# Altium project BSU.PrjPcb (part 2 of 2)
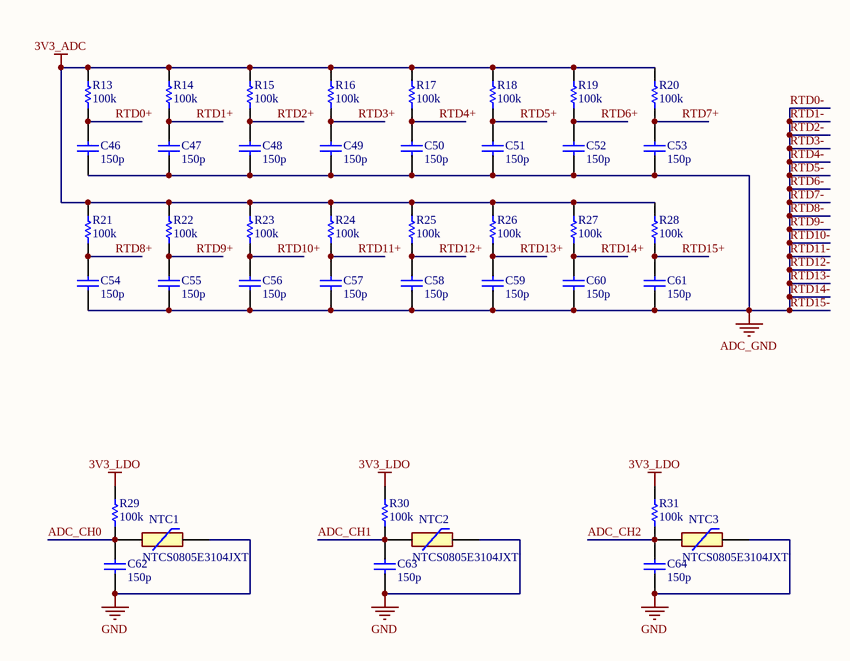
[diagram p8: BSU_RTD.SchDoc]

## Nets that join several sheets
3V3_ADC: BSU_Power (C24.2 LDO2.5), BSU_EADC (ADC1.28 ADC2.28 C33.1 C34.1), BSU_RTD (16 pins)
3V3_LDO: BSU_Connector (SB4.2), BSU_Power (C20.2 LDO1.5), BSU_RTD (R29.2 R30.2 R31.2)
+5V: BSU_Connector (J18.4 SB1.2 SB2.1 SB3.1), BSU_Power (6 pins), BSU_Comm (13 pins)
+5V_ADC: BSU_Power (6 pins), BSU_Comm (6 pins), BSU_EADC (12 pins)
+5V_STM: BSU_Connector (J5.1 STM32.28), BSU_Power (R10.2)
BAT_GND: BSU_BQ796XX (C1.2), BSU_Sensing (C81.2 C114.1 R48.1)
BQ1_GND: BSU_BQ796XX (12 pins), BSU_Comm (5 pins), BSU_Sensing (C134.1)
BQ2_GND: BSU_BQ796XX (12 pins), BSU_Comm (C141.1 C142.1), BSU_Sensing (C133.1)
CVDD1: BSU_BQ796XX (BQ1.45 C9.1), BSU_Comm (C26.2 U3.1 U3.7)
GND: BSU_Connector (23 pins), BSU_Power (14 pins), BSU_Comm (15 pins), BSU_RTD (6 pins)
RTD0-: BSU_Connector (18 pins), BSU_Power (6 pins), BSU_Comm (6 pins), BSU_ESD (8 pins), BSU_EADC (27 pins), BSU_RTD (16 pins)
VIN: BSU_Connector (J1.1), BSU_Power (X1.1)
ADC1_CS: BSU_Comm (U4.14), BSU_EADC (ADC1.23)
ADC1_MISO: BSU_Comm (U4.11), BSU_EADC (ADC1.26)
ADC1_MOSI: BSU_Comm (U4.12), BSU_EADC (ADC1.25)
ADC1_SCK: BSU_Comm (U4.13), BSU_EADC (ADC1.24)
ADC2_CS: BSU_Comm (U5.14), BSU_EADC (ADC2.23)
ADC2_MISO: BSU_Comm (U5.11), BSU_EADC (ADC2.26)
ADC2_MOSI: BSU_Comm (U5.12), BSU_EADC (ADC2.25)
ADC2_SCK: BSU_Comm (U5.13), BSU_EADC (ADC2.24)
ADC_CH0: BSU_Connector (STM32.33), BSU_RTD (C62.2 NTC1.2 R29.1)
ADC_CH1: BSU_Connector (STM32.34), BSU_RTD (C63.2 NTC2.2 R30.1)
ADC_CH2: BSU_Connector (STM32.56), BSU_RTD (C64.2 NTC3.2 R31.1)
BAT16: BSU_BQ796XX (BQ1.1), BSU_Sensing (C132.2 C134.2 R100.2)
BAT32: BSU_BQ796XX (BQ2.1), BSU_Sensing (C131.2 C133.2 R99.2)
BQ1_DAISY_N: BSU_BQ796XX (BQ1.42), BSU_Comm (C136.2 R101.2 R102.2)
BQ1_DAISY_P: BSU_BQ796XX (BQ1.43), BSU_Comm (C135.2 R101.1 R103.2)
BQ2_DAISY_N: BSU_BQ796XX (BQ2.41), BSU_Comm (C141.2 R104.2 R106.1)
BQ2_DAISY_P: BSU_BQ796XX (BQ2.40), BSU_Comm (C142.2 R105.2 R106.2)
BQ796XX_RX: BSU_Connector (STM32.20), BSU_Comm (U3.12)
BQ796XX_RX_HV: BSU_BQ796XX (BQ1.53), BSU_Comm (U3.5)
BQ796XX_TX: BSU_Connector (STM32.1), BSU_Comm (U3.11)
BQ796XX_TX_HV: BSU_BQ796XX (BQ1.52), BSU_Comm (U3.6)
BT0: BSU_Connector (J3.21), BSU_Sensing (F1.1)
BT0_F: BSU_Sensing (F1.2 R48.2 R49.1 R82.1), BSU_ESD (TVS1.2 TVS17.2)
BT1: BSU_Connector (J3.1), BSU_Sensing (F2.1)
BT1_F: BSU_Sensing (F2.2 R50.1 R83.1), BSU_ESD (TVS1.3)
BT2: BSU_Connector (J3.22), BSU_Sensing (F3.1)
BT2_F: BSU_Sensing (F3.2 R51.1 R84.1), BSU_ESD (TVS1.1 TVS2.2)
BT3: BSU_Connector (J3.2), BSU_Sensing (F4.1)
BT3_F: BSU_Sensing (F4.2 R52.1 R85.1), BSU_ESD (TVS2.3)
BT4: BSU_Connector (J3.23), BSU_Sensing (F5.1)
BT4_F: BSU_Sensing (F5.2 R53.1 R86.1), BSU_ESD (TVS2.1 TVS3.2)
BT5: BSU_Connector (J3.3), BSU_Sensing (F6.1)
BT5_F: BSU_Sensing (F6.2 R54.1 R87.1), BSU_ESD (TVS3.3)
BT6: BSU_Connector (J3.24), BSU_Sensing (F7.1)
BT6_F: BSU_Sensing (F7.2 R55.1 R88.1), BSU_ESD (TVS3.1 TVS4.2)
BT7: BSU_Connector (J3.4), BSU_Sensing (F8.1)
BT7_F: BSU_Sensing (F8.2 R56.1 R89.1), BSU_ESD (TVS4.3)
BT8: BSU_Connector (J3.25), BSU_Sensing (F9.1)
BT8_F: BSU_Sensing (F9.2 R57.1 R90.1), BSU_ESD (TVS4.1 TVS5.2)
BT9: BSU_Connector (J3.5), BSU_Sensing (F10.1)
BT9_F: BSU_Sensing (F10.2 R58.1 R91.1), BSU_ESD (TVS5.3)
BT10: BSU_Connector (J3.26), BSU_Sensing (F11.1)
BT10_F: BSU_Sensing (F11.2 R59.1 R92.1), BSU_ESD (TVS5.1 TVS6.2)
BT11: BSU_Connector (J3.6), BSU_Sensing (F12.1)
BT11_F: BSU_Sensing (F12.2 R60.1 R93.1), BSU_ESD (TVS6.3)
BT12: BSU_Connector (J3.27), BSU_Sensing (F13.1)
BT12_F: BSU_Sensing (F13.2 R61.1 R94.1), BSU_ESD (TVS6.1 TVS7.2)
BT13: BSU_Connector (J3.7), BSU_Sensing (F14.1)
BT13_F: BSU_Sensing (F14.2 R62.1 R95.1), BSU_ESD (TVS7.3)
BT14: BSU_Connector (J3.28), BSU_Sensing (F15.1)
BT14_F: BSU_Sensing (F15.2 R63.1 R96.1), BSU_ESD (TVS7.1 TVS8.2)
BT15: BSU_Connector (J3.8), BSU_Sensing (F16.1)
BT15_F: BSU_Sensing (F16.2 R64.1 R97.1), BSU_ESD (TVS8.3)
BT16: BSU_Connector (J3.29), BSU_Sensing (F17.1)
BT16_F: BSU_BQ796XX (C2.2 R2.2), BSU_Sensing (F17.2 R65.1 R98.1 R100.1), BSU_ESD (TVS8.1 TVS9.2 TVS17.1 TVS18.2)
BT17: BSU_Connector (J3.9), BSU_Sensing (F18.1)
BT17_F: BSU_Sensing (F18.2 R32.1 R66.1), BSU_ESD (TVS9.3)
BT18: BSU_Connector (J3.30), BSU_Sensing (F19.1)
BT18_F: BSU_Sensing (F19.2 R33.1 R67.1), BSU_ESD (TVS9.1 TVS10.2)
BT19: BSU_Connector (J3.10), BSU_Sensing (F20.1)
BT19_F: BSU_Sensing (F20.2 R34.1 R68.1), BSU_ESD (TVS10.3)
BT20: BSU_Connector (J3.31), BSU_Sensing (F21.1)
BT20_F: BSU_Sensing (F21.2 R35.1 R69.1), BSU_ESD (TVS10.1 TVS11.2)
BT21: BSU_Connector (J3.11), BSU_Sensing (F22.1)
BT21_F: BSU_Sensing (F22.2 R36.1 R70.1), BSU_ESD (TVS11.3)
BT22: BSU_Connector (J3.32), BSU_Sensing (F23.1)
BT22_F: BSU_Sensing (F23.2 R37.1 R71.1), BSU_ESD (TVS11.1 TVS12.2)
BT23: BSU_Connector (J3.12), BSU_Sensing (F24.1)
BT23_F: BSU_Sensing (F24.2 R38.1 R72.1), BSU_ESD (TVS12.3)
BT24: BSU_Connector (J3.33), BSU_Sensing (F25.1)
BT24_F: BSU_Sensing (F25.2 R39.1 R73.1), BSU_ESD (TVS12.1 TVS13.2)
BT25: BSU_Connector (J3.13), BSU_Sensing (F26.1)
BT25_F: BSU_Sensing (F26.2 R40.1 R74.1), BSU_ESD (TVS13.3)
BT26: BSU_Connector (J3.34), BSU_Sensing (F27.1)
BT26_F: BSU_Sensing (F27.2 R41.1 R75.1), BSU_ESD (TVS13.1 TVS14.2)
BT27: BSU_Connector (J3.14), BSU_Sensing (F28.1)
BT27_F: BSU_Sensing (F28.2 R42.1 R76.1), BSU_ESD (TVS14.3)
BT28: BSU_Connector (J3.35), BSU_Sensing (F29.1)
BT28_F: BSU_Sensing (F29.2 R43.1 R77.1), BSU_ESD (TVS14.1 TVS15.2)
BT29: BSU_Connector (J3.15), BSU_Sensing (F30.1)
BT29_F: BSU_Sensing (F30.2 R44.1 R78.1), BSU_ESD (TVS15.3)
BT30: BSU_Connector (J3.36), BSU_Sensing (F31.1)
BT30_F: BSU_Sensing (F31.2 R45.1 R79.1), BSU_ESD (TVS15.1 TVS16.2)
BT31: BSU_Connector (J3.16), BSU_Sensing (F32.1)
BT31_F: BSU_Sensing (F32.2 R46.1 R80.1), BSU_ESD (TVS16.3)
BT32: BSU_Connector (J3.37), BSU_Sensing (F33.1)
BT32_F: BSU_BQ796XX (R4.2), BSU_Sensing (F33.2 R47.1 R81.1 R99.1), BSU_ESD (TVS16.1 TVS18.1)
CAN_DBG_H: BSU_Connector (J11.1), BSU_Comm (U6.7)
CAN_DBG_L: BSU_Connector (J11.2), BSU_Comm (U6.6)
CAN_DBG_RX: BSU_Connector (STM32.65), BSU_Comm (U6.4)
CAN_DBG_TX: BSU_Connector (STM32.72), BSU_Comm (U6.1)
CAN_IBUS_H: BSU_Connector (J4.1), BSU_Comm (U7.7)
CAN_IBUS_L: BSU_Connector (J4.2), BSU_Comm (U7.6)
CAN_IBUS_RX: BSU_Connector (STM32.40), BSU_Comm (U7.4)
CAN_IBUS_TX: BSU_Connector (STM32.41), BSU_Comm (U7.1)
CB0: BSU_BQ796XX (BQ1.34), BSU_Sensing (C114.2 C115.1 R82.2)
CB1: BSU_BQ796XX (BQ1.32), BSU_Sensing (C115.2 C116.1 R83.2)
CB2: BSU_BQ796XX (BQ1.30), BSU_Sensing (C116.2 C117.1 R84.2)
CB3: BSU_BQ796XX (BQ1.28), BSU_Sensing (C117.2 C118.1 R85.2)
CB4: BSU_BQ796XX (BQ1.26), BSU_Sensing (C118.2 C119.1 R86.2)
CB5: BSU_BQ796XX (BQ1.24), BSU_Sensing (C119.2 C120.1 R87.2)
CB6: BSU_BQ796XX (BQ1.22), BSU_Sensing (C120.2 C121.1 R88.2)
CB7: BSU_BQ796XX (BQ1.20), BSU_Sensing (C121.2 C122.1 R89.2)
CB8: BSU_BQ796XX (BQ1.18), BSU_Sensing (C122.2 C123.1 R90.2)
CB9: BSU_BQ796XX (BQ1.16), BSU_Sensing (C123.2 C124.1 R91.2)
CB10: BSU_BQ796XX (BQ1.14), BSU_Sensing (C124.2 C125.1 R92.2)
CB11: BSU_BQ796XX (BQ1.12), BSU_Sensing (C125.2 C126.1 R93.2)
CB12: BSU_BQ796XX (BQ1.10), BSU_Sensing (C126.2 C127.1 R94.2)
CB13: BSU_BQ796XX (BQ1.8), BSU_Sensing (C127.2 C128.1 R95.2)
CB14: BSU_BQ796XX (BQ1.6), BSU_Sensing (C128.2 C129.1 R96.2)
CB15: BSU_BQ796XX (BQ1.4), BSU_Sensing (C129.2 C130.1 R97.2)
CB16: BSU_BQ796XX (BQ1.2 BQ2.34), BSU_Sensing (C98.1 C130.2 C132.1 R98.2)
CB17: BSU_BQ796XX (BQ2.32), BSU_Sensing (C98.2 C99.1 R66.2)
CB18: BSU_BQ796XX (BQ2.30), BSU_Sensing (C99.2 C100.1 R67.2)
CB19: BSU_BQ796XX (BQ2.28), BSU_Sensing (C100.2 C101.1 R68.2)
CB20: BSU_BQ796XX (BQ2.26), BSU_Sensing (C101.2 C102.1 R69.2)
CB21: BSU_BQ796XX (BQ2.24), BSU_Sensing (C102.2 C103.1 R70.2)
CB22: BSU_BQ796XX (BQ2.22), BSU_Sensing (C103.2 C104.1 R71.2)
CB23: BSU_BQ796XX (BQ2.20), BSU_Sensing (C104.2 C105.1 R72.2)
CB24: BSU_BQ796XX (BQ2.18), BSU_Sensing (C105.2 C106.1 R73.2)
CB25: BSU_BQ796XX (BQ2.16), BSU_Sensing (C106.2 C107.1 R74.2)
CB26: BSU_BQ796XX (BQ2.14), BSU_Sensing (C107.2 C108.1 R75.2)
CB27: BSU_BQ796XX (BQ2.12), BSU_Sensing (C108.2 C109.1 R76.2)
CB28: BSU_BQ796XX (BQ2.10), BSU_Sensing (C109.2 C110.1 R77.2)
CB29: BSU_BQ796XX (BQ2.8), BSU_Sensing (C110.2 C111.1 R78.2)
CB30: BSU_BQ796XX (BQ2.6), BSU_Sensing (C111.2 C112.1 R79.2)
CB31: BSU_BQ796XX (BQ2.4), BSU_Sensing (C112.2 C113.1 R80.2)
CB32: BSU_BQ796XX (BQ2.2), BSU_Sensing (C113.2 C131.1 R81.2)
EADC1_MISO: BSU_Connector (J14.4 STM32.45), BSU_Comm (U4.6)
EADC1_MOSI: BSU_Connector (J14.3 STM32.46), BSU_Comm (U4.5)
EADC1_SCK: BSU_Connector (J14.2 STM32.44), BSU_Comm (U4.4)
EADC2_MISO: BSU_Connector (J15.4 STM32.18), BSU_Comm (U5.6)
EADC2_MOSI: BSU_Connector (J15.3 STM32.19), BSU_Comm (U5.5)
EADC2_SCK: BSU_Connector (J15.2 STM32.48), BSU_Comm (U5.4)
EADC_CS: BSU_Connector (J14.1 J15.1 STM32.35), BSU_Comm (U4.3 U5.3)
GPI_CH0: BSU_Connector (STM32.51), BSU_Comm (U3.14)
GPI_CH1: BSU_Connector (STM32.68), BSU_Comm (U3.13)
LED_PWR: BSU_Connector (STM32.12), BSU_Power (R8.2)
LED_STS: BSU_Connector (STM32.9), BSU_Power (R9.2)
NFAULT1_HV: BSU_BQ796XX (BQ1.62), BSU_Comm (U3.4)
NFAULT2_HV: BSU_BQ796XX (BQ2.62), BSU_Comm (U3.3)
RTD0+: BSU_Connector (J2.17), BSU_ESD (TVS19.2), BSU_EADC (ADC1.20), BSU_RTD (C46.2 R13.1)
RTD1+: BSU_Connector (J2.18), BSU_ESD (TVS19.1), BSU_EADC (ADC1.19), BSU_RTD (C47.2 R14.1)
RTD2+: BSU_Connector (J2.19), BSU_ESD (TVS20.2), BSU_EADC (ADC1.18), BSU_RTD (C48.2 R15.1)
RTD3+: BSU_Connector (J2.20), BSU_ESD (TVS20.1), BSU_EADC (ADC1.17), BSU_RTD (C49.2 R16.1)
RTD4+: BSU_Connector (J2.21), BSU_ESD (TVS21.2), BSU_EADC (ADC1.14), BSU_RTD (C50.2 R17.1)
RTD5+: BSU_Connector (J2.22), BSU_ESD (TVS21.1), BSU_EADC (ADC1.13), BSU_RTD (C51.2 R18.1)
RTD6+: BSU_Connector (J2.23), BSU_ESD (TVS22.2), BSU_EADC (ADC1.12), BSU_RTD (C52.2 R19.1)
RTD7+: BSU_Connector (J2.24), BSU_ESD (TVS22.1), BSU_EADC (ADC1.11), BSU_RTD (C53.2 R20.1)
RTD8+: BSU_Connector (J2.25), BSU_ESD (TVS23.2), BSU_EADC (ADC2.20), BSU_RTD (C54.2 R21.1)
RTD9+: BSU_Connector (J2.26), BSU_ESD (TVS23.1), BSU_EADC (ADC2.19), BSU_RTD (C55.2 R22.1)
RTD10+: BSU_Connector (J2.27), BSU_ESD (TVS24.2), BSU_EADC (ADC2.18), BSU_RTD (C56.2 R23.1)
RTD11+: BSU_Connector (J2.28), BSU_ESD (TVS24.1), BSU_EADC (ADC2.17), BSU_RTD (C57.2 R24.1)
RTD12+: BSU_Connector (J2.29), BSU_ESD (TVS25.2), BSU_EADC (ADC2.14), BSU_RTD (C58.2 R25.1)
RTD13+: BSU_Connector (J2.30), BSU_ESD (TVS25.1), BSU_EADC (ADC2.13), BSU_RTD (C59.2 R26.1)
RTD14+: BSU_Connector (J2.31), BSU_ESD (TVS26.2), BSU_EADC (ADC2.12), BSU_RTD (C60.2 R27.1)
RTD15+: BSU_Connector (J2.32), BSU_ESD (TVS26.1), BSU_EADC (ADC2.11), BSU_RTD (C61.2 R28.1)
VC0: BSU_BQ796XX (BQ1.35), BSU_Sensing (C81.1 C82.1 R49.2)
VC1: BSU_BQ796XX (BQ1.33), BSU_Sensing (C82.2 C83.1 R50.2)
VC2: BSU_BQ796XX (BQ1.31), BSU_Sensing (C83.2 C84.1 R51.2)
VC3: BSU_BQ796XX (BQ1.29), BSU_Sensing (C84.2 C85.1 R52.2)
VC4: BSU_BQ796XX (BQ1.27), BSU_Sensing (C85.2 C86.1 R53.2)
VC5: BSU_BQ796XX (BQ1.25), BSU_Sensing (C86.2 C87.1 R54.2)
VC6: BSU_BQ796XX (BQ1.23), BSU_Sensing (C87.2 C88.1 R55.2)
VC7: BSU_BQ796XX (BQ1.21), BSU_Sensing (C88.2 C89.1 R56.2)
VC8: BSU_BQ796XX (BQ1.19), BSU_Sensing (C89.2 C90.1 R57.2)
VC9: BSU_BQ796XX (BQ1.17), BSU_Sensing (C90.2 C91.1 R58.2)
VC10: BSU_BQ796XX (BQ1.15), BSU_Sensing (C91.2 C92.1 R59.2)
VC11: BSU_BQ796XX (BQ1.13), BSU_Sensing (C92.2 C93.1 R60.2)
VC12: BSU_BQ796XX (BQ1.11), BSU_Sensing (C93.2 C94.1 R61.2)
VC13: BSU_BQ796XX (BQ1.9), BSU_Sensing (C94.2 C95.1 R62.2)
VC14: BSU_BQ796XX (BQ1.7), BSU_Sensing (C95.2 C96.1 R63.2)
VC15: BSU_BQ796XX (BQ1.5), BSU_Sensing (C96.2 C97.1 R64.2)
VC16: BSU_BQ796XX (BQ1.3 BQ2.35), BSU_Sensing (C65.1 C97.2 R65.2)
VC17: BSU_BQ796XX (BQ2.33), BSU_Sensing (C65.2 C66.1 R32.2)
VC18: BSU_BQ796XX (BQ2.31), BSU_Sensing (C66.2 C67.1 R33.2)
VC19: BSU_BQ796XX (BQ2.29), BSU_Sensing (C67.2 C68.1 R34.2)
VC20: BSU_BQ796XX (BQ2.27), BSU_Sensing (C68.2 C69.1 R35.2)
VC21: BSU_BQ796XX (BQ2.25), BSU_Sensing (C69.2 C70.1 R36.2)
VC22: BSU_BQ796XX (BQ2.23), BSU_Sensing (C70.2 C71.1 R37.2)
VC23: BSU_BQ796XX (BQ2.21), BSU_Sensing (C71.2 C72.1 R38.2)
VC24: BSU_BQ796XX (BQ2.19), BSU_Sensing (C72.2 C73.1 R39.2)
VC25: BSU_BQ796XX (BQ2.17), BSU_Sensing (C73.2 C74.1 R40.2)
VC26: BSU_BQ796XX (BQ2.15), BSU_Sensing (C74.2 C75.1 R41.2)
VC27: BSU_BQ796XX (BQ2.13), BSU_Sensing (C75.2 C76.1 R42.2)
VC28: BSU_BQ796XX (BQ2.11), BSU_Sensing (C76.2 C77.1 R43.2)
VC29: BSU_BQ796XX (BQ2.9), BSU_Sensing (C77.2 C78.1 R44.2)
VC30: BSU_BQ796XX (BQ2.7), BSU_Sensing (C78.2 C79.1 R45.2)
VC31: BSU_BQ796XX (BQ2.5), BSU_Sensing (C79.2 C80.1 R46.2)
VC32: BSU_BQ796XX (BQ2.3), BSU_Sensing (C80.2 R47.2)